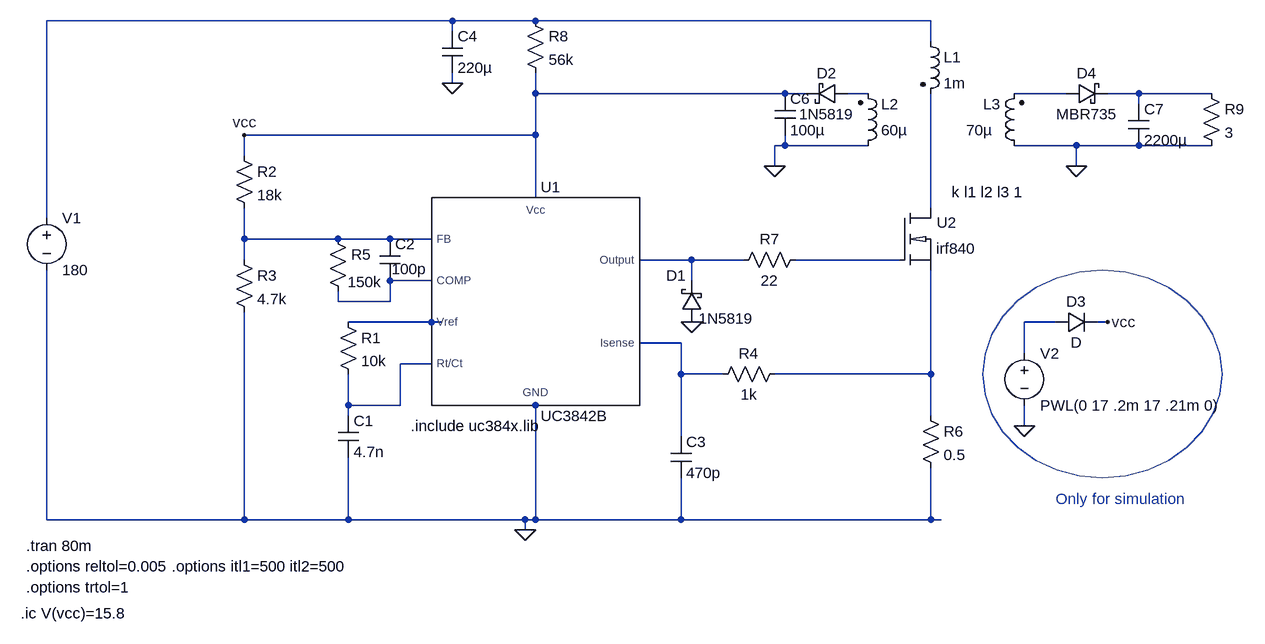
[diagram p0: schematic uc3842_mains_flyback1.asc]
uc3842_mains_flyback1.asc, the LTspice schematic file:
Version 4
SHEET 1 1228 808
WIRE 0 -144 -624 -144
WIRE 128 -144 0 -144
WIRE 736 -144 128 -144
WIRE 0 -128 0 -144
WIRE 736 -112 736 -144
WIRE 0 -48 0 -64
WIRE 128 -32 128 -64
WIRE 512 -32 128 -32
WIRE 544 -32 512 -32
WIRE 640 -32 608 -32
WIRE 944 -32 864 -32
WIRE 1056 -32 1008 -32
WIRE 1168 -32 1056 -32
WIRE 1056 -16 1056 -32
WIRE 128 32 128 -32
WIRE 128 32 -320 32
WIRE 512 48 512 32
WIRE 512 48 496 48
WIRE 640 48 512 48
WIRE 960 48 864 48
WIRE 1056 48 960 48
WIRE 1168 48 1056 48
WIRE -320 64 -320 32
WIRE 496 80 496 48
WIRE 960 80 960 48
WIRE 128 128 128 32
WIRE 736 144 736 -32
WIRE -624 160 -624 -144
WIRE -320 192 -320 144
WIRE -176 192 -320 192
WIRE -96 192 -176 192
WIRE -32 192 -96 192
WIRE -320 224 -320 192
WIRE 368 224 288 224
WIRE 448 224 368 224
WIRE 688 224 528 224
WIRE -32 256 -96 256
WIRE 368 256 368 224
WIRE -176 288 -176 272
WIRE -96 288 -96 256
WIRE -96 288 -176 288
WIRE -32 320 -160 320
WIRE -16 320 -32 320
WIRE 928 320 880 320
WIRE 1008 320 992 320
WIRE 352 352 288 352
WIRE 880 368 880 320
WIRE -32 384 -80 384
WIRE 352 400 352 352
WIRE 416 400 352 400
WIRE 736 400 736 240
WIRE 736 400 496 400
WIRE -160 448 -160 400
WIRE -80 448 -80 384
WIRE -80 448 -160 448
WIRE 128 448 112 448
WIRE -160 464 -160 448
WIRE 736 464 736 400
WIRE 880 480 880 448
WIRE 352 496 352 400
WIRE -624 624 -624 240
WIRE -320 624 -320 304
WIRE -320 624 -624 624
WIRE -160 624 -160 528
WIRE -160 624 -320 624
WIRE 112 624 -160 624
WIRE 128 624 128 448
WIRE 128 624 112 624
WIRE 352 624 352 560
WIRE 352 624 128 624
WIRE 736 624 736 544
WIRE 736 624 352 624
WIRE 752 624 736 624
WIRE 112 640 112 624
FLAG 112 640 0
FLAG 368 320 0
FLAG 0 -48 0
FLAG 496 80 0
FLAG 960 80 0
FLAG -320 32 vcc
FLAG 880 480 0
FLAG 1008 320 vcc
SYMBOL UC3845B 128 288 R0
SYMATTR InstName U1
SYMATTR Value UC3842B
SYMBOL res -176 304 R0
SYMATTR InstName R1
SYMATTR Value 10k
SYMBOL res -336 48 R0
SYMATTR InstName R2
SYMATTR Value 18k
SYMBOL res -336 208 R0
SYMATTR InstName R3
SYMATTR Value 4.7k
SYMBOL res 512 384 R90
WINDOW 0 0 56 VBottom 0
WINDOW 3 32 56 VTop 0
SYMATTR InstName R4
SYMATTR Value 1k
SYMBOL cap -176 464 R0
SYMATTR InstName C1
SYMATTR Value 4.7n
SYMBOL cap -112 192 R0
WINDOW 3 19 46 Left 0
SYMATTR InstName C2
SYMATTR Value 100p
SYMBOL res -192 176 R0
WINDOW 3 31 82 Left 0
SYMATTR InstName R5
SYMATTR Value 150k
SYMBOL res 720 448 R0
SYMATTR InstName R6
SYMATTR Value 0.5
SYMBOL cap 336 496 R0
SYMATTR InstName C3
SYMATTR Value 470p
SYMBOL res 544 208 R90
WINDOW 0 0 56 VBottom 0
WINDOW 3 32 56 VTop 0
SYMATTR InstName R7
SYMATTR Value 22
SYMBOL nmos\ robin 688 144 R0
SYMATTR InstName U2
SYMATTR SpiceModel irf840
SYMBOL schottky 384 320 R180
WINDOW 0 24 72 Left 0
WINDOW 3 -80 6 Left 0
SYMATTR InstName D1
SYMATTR Value 1N5819
SYMATTR Description Diode
SYMATTR Type diode
SYMBOL res 112 -160 R0
SYMATTR InstName R8
SYMATTR Value 56k
SYMBOL cap -16 -128 R0
SYMATTR InstName C4
SYMATTR Value 220µ
SYMBOL ind2 720 -128 R0
SYMATTR InstName L1
SYMATTR Value 1m
SYMATTR Type ind
SYMBOL ind2 624 64 M180
WINDOW 0 36 80 Left 0
WINDOW 3 36 40 Left 0
SYMATTR InstName L2
SYMATTR Value 60µ
SYMATTR Type ind
SYMBOL schottky 608 -48 R90
WINDOW 0 0 32 VBottom 0
WINDOW 3 32 32 VTop 0
SYMATTR InstName D2
SYMATTR Value 1N5819
SYMATTR Description Diode
SYMATTR Type diode
SYMBOL cap 496 -32 R0
SYMATTR InstName C6
SYMATTR Value 100µ
SYMBOL ind2 880 64 R180
WINDOW 0 36 80 Left 0
WINDOW 3 49 40 Left 0
SYMATTR InstName L3
SYMATTR Value 70µ
SYMATTR Type ind
SYMBOL schottky 944 -16 R270
WINDOW 0 32 32 VTop 0
WINDOW 3 0 32 VBottom 0
SYMATTR InstName D4
SYMATTR Value MBR735
SYMATTR Description Diode
SYMATTR Type diode
SYMBOL cap 1040 -16 R0
SYMATTR InstName C7
SYMATTR Value 2200µ
SYMBOL voltage -624 144 R0
WINDOW 123 0 0 Left 0
WINDOW 39 0 0 Left 0
SYMATTR InstName V1
SYMATTR Value 180
SYMBOL res 1152 -48 R0
SYMATTR InstName R9
SYMATTR Value 3
SYMBOL voltage 880 352 R0
WINDOW 123 0 0 Left 0
WINDOW 39 24 132 Left 0
SYMATTR InstName V2
SYMATTR Value PWL(0 17 .2m 17 .21m 0)
SYMBOL diode 928 336 R270
WINDOW 0 32 32 VTop 0
WINDOW 3 0 32 VBottom 0
SYMATTR InstName D3
TEXT -656 664 Left 0 !.tran 80m
TEXT -64 480 Left 0 !.include uc384x.lib
TEXT 768 120 Left 0 !k l1 l2 l3 1
TEXT -656 696 Left 0 !.options reltol=0.005
TEXT -656 728 Left 0 !.options trtol=1
TEXT -664 768 Left 0 !.ic V(vcc)=15.8
TEXT 928 592 Left 0 ;Only for simulation
TEXT -432 696 Left 0 !.options itl1=500 itl2=500
CIRCLE Normal 1184 560 816 240

The netlist it stands for:
* uc3842_mains_flyback1.asc
XU1 N009 N006 N012 N013 0 N007 vcc N010 UC3842B  ; pins COMP FB Isense Rt/Ct GND Output Vcc Vref
R1 N010 N013 10k
R2 vcc N006 18k
R3 N006 0 4.7k
R4 N014 N012 1k
C1 N013 0 4.7n
C2 N006 N009 100p
R5 N006 N009 150k
R6 N014 0 0.5
C3 N012 0 470p
R7 N008 N007 22
XU2 N005 N008 N014 irf840  ; pins D G S
D1 0 N007 1N5819
R8 N001 vcc 56k
C4 N001 0 220µ
L1 N001 N005 1m
L2 0 N002 60µ
D2 N002 vcc 1N5819
C6 vcc 0 100µ
L3 0 N003 70µ
D4 N003 N004 MBR735
C7 N004 0 2200µ
V1 N001 0 180
R9 N004 0 3
V2 N011 0 PWL(0 17 .2m 17 .21m 0)
D3 N011 vcc D
.model D D
.lib standard.dio
.tran 80m
.include uc384x.lib
k l1 l2 l3 1
.options reltol=0.005
.options trtol=1
.ic V(vcc)=15.8
* Only for simulation
.options itl1=500 itl2=500
.lib irf nmosfet.lib
.backanno
.end